# Altium schematic sheet AVCC.SchDoc
size 60 x 25 mm
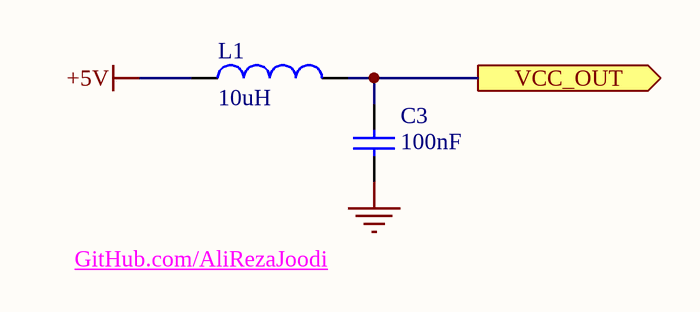
[diagram p0: AVCC.SchDoc]

## Parts
C3  value 100nF  [CAPNTO2.54-3.05x1.78A]  (hidden comment: Cap)
L1  value 10uH  [Inductor_1]  (hidden comment: Inductor)

## Ports
VCC_OUT (out)

## Nets
+5V: L1.1
GND: C3.2
VCC_OUT: C3.1 L1.2 ; port VCC_OUT

## Notes on the sheet
- (near C3) GitHub.com/AliRezaJoodi

## Library data of the parts
C3 = Cap: Capacitor; Manufacturer: Generic Components; Class I: Passive; Published: 8-Jun-2000; Revision: July-2002: Re-released for DXP Platform.; Publisher: Altium Limited; Class II: Capacitor
L1 = Inductor: Manufacturer: Generic Components; Class I: Passive; Published: 8-Jun-2000; Revision: July-2002: Re-released for DXP Platform.; Publisher: Altium Limited; Class II: Inductor; Supplier 1: Newark